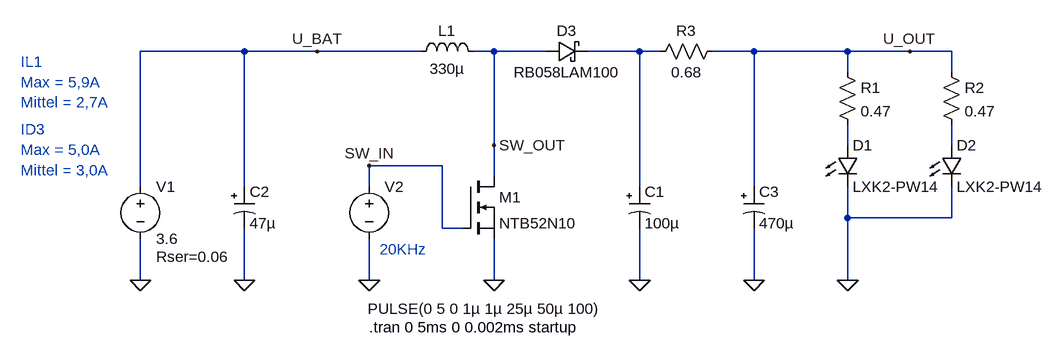
[diagram p0: schematic Boost_Converter.asc]
Boost_Converter.asc, the LTspice schematic file:
Version 4
SHEET 1 996 680
WIRE -240 176 -400 176
WIRE -128 176 -240 176
WIRE 32 176 -128 176
WIRE 144 176 112 176
WIRE 224 176 144 176
WIRE 368 176 288 176
WIRE 400 176 368 176
WIRE 544 176 480 176
WIRE 688 176 544 176
WIRE 784 176 688 176
WIRE 848 176 784 176
WIRE 688 208 688 176
WIRE 848 208 848 176
WIRE 144 320 144 176
WIRE 688 320 688 288
WIRE 848 320 848 288
WIRE 64 352 -48 352
WIRE 144 368 144 320
WIRE -400 384 -400 176
WIRE -240 384 -240 176
WIRE -48 384 -48 352
WIRE 368 384 368 176
WIRE 544 384 544 176
WIRE 688 432 688 384
WIRE 848 432 848 384
WIRE 848 432 688 432
WIRE 64 448 64 352
WIRE 96 448 64 448
WIRE -400 528 -400 464
WIRE -240 528 -240 448
WIRE -48 528 -48 464
WIRE 144 528 144 464
WIRE 368 528 368 448
WIRE 544 528 544 448
WIRE 688 528 688 432
FLAG -400 528 0
FLAG -48 528 0
FLAG 144 528 0
FLAG 688 528 0
FLAG 368 528 0
FLAG -48 352 SW_IN
FLAG 144 320 SW_OUT
FLAG -128 176 U_BAT
FLAG 784 176 U_OUT
FLAG -240 528 0
FLAG 544 528 0
SYMBOL voltage -400 368 R0
WINDOW 123 0 0 Left 0
WINDOW 39 24 124 Left 2
SYMATTR SpiceLine Rser=0.06
SYMATTR InstName V1
SYMATTR Value 3.6
SYMBOL res 672 192 R0
SYMATTR InstName R1
SYMATTR Value 0.47
SYMATTR SpiceLine tol=2 pwr=1
SYMBOL res 832 192 R0
SYMATTR InstName R2
SYMATTR Value 0.47
SYMATTR SpiceLine tol=2 pwr=1
SYMBOL LED 672 320 R0
SYMATTR InstName D1
SYMATTR Value LXK2-PW14
SYMATTR Description Diode
SYMATTR Type diode
SYMBOL LED 832 320 R0
SYMATTR InstName D2
SYMATTR Value LXK2-PW14
SYMATTR Description Diode
SYMATTR Type diode
SYMBOL nmos 96 368 R0
SYMATTR InstName M1
SYMATTR Value NTB52N10
SYMBOL voltage -48 368 R0
WINDOW 3 -2 204 Left 2
WINDOW 123 0 0 Left 0
WINDOW 39 0 0 Left 0
SYMATTR Value PULSE(0 5 0 1µ 1µ 25µ 50µ 100)
SYMATTR InstName V2
SYMBOL polcap 352 384 R0
WINDOW 3 24 56 Left 2
SYMATTR Value 100µ
SYMATTR InstName C1
SYMATTR Description Capacitor
SYMATTR Type cap
SYMATTR SpiceLine V=25 Irms=750m Rser=0.16 Lser=0
SYMBOL ind 16 192 R270
WINDOW 0 32 56 VTop 2
WINDOW 3 5 56 VBottom 2
SYMATTR InstName L1
SYMATTR Value 330µ
SYMATTR SpiceLine Ipk=2.8 Rser=0.23 Rpar=86577.4 Cpar=0
SYMBOL schottky 224 192 R270
WINDOW 0 32 32 VTop 2
WINDOW 3 0 32 VBottom 2
SYMATTR InstName D3
SYMATTR Value RB058LAM100
SYMATTR Description Diode
SYMATTR Type diode
SYMBOL polcap -256 384 R0
WINDOW 3 24 56 Left 2
SYMATTR Value 47µ
SYMATTR InstName C2
SYMATTR Description Capacitor
SYMATTR Type cap
SYMATTR SpiceLine V=25 Irms=750m Rser=0.16 Lser=0
SYMBOL polcap 528 384 R0
WINDOW 3 24 56 Left 2
SYMATTR Value 470µ
SYMATTR InstName C3
SYMATTR Description Capacitor
SYMATTR Type cap
SYMATTR SpiceLine V=25 Irms=750m Rser=0.16 Lser=0
SYMBOL res 496 160 R90
WINDOW 0 0 56 VBottom 2
WINDOW 3 32 56 VTop 2
SYMATTR InstName R3
SYMATTR Value 0.68
SYMATTR SpiceLine tol=2 pwr=1
TEXT -48 600 Left 2 !.tran 0 5ms 0 0.002ms startup
TEXT -584 192 Left 2 ;IL1\nMax = 5,9A\nMittel = 2,7A
TEXT -584 296 Left 2 ;ID3\nMax = 5,0A\nMittel = 3,0A
TEXT -32 480 Left 2 ;20KHz

The netlist it stands for:
* Boost_Converter.asc
V1 U_BAT 0 3.6 Rser=0.06
R1 U_OUT N002 0.47 tol=2 pwr=1
R2 U_OUT N003 0.47 tol=2 pwr=1
D1 N002 0 LXK2-PW14
D2 N003 0 LXK2-PW14
M1 SW_OUT SW_IN 0 0 NTB52N10
V2 SW_IN 0 PULSE(0 5 0 1µ 1µ 25µ 50µ 100)
C1 N001 0 100µ V=25 Irms=750m Rser=0.16 Lser=0
L1 U_BAT SW_OUT 330µ Ipk=2.8 Rser=0.23 Rpar=86577.4 Cpar=0
D3 SW_OUT N001 RB058LAM100
C2 U_BAT 0 47µ V=25 Irms=750m Rser=0.16 Lser=0
C3 U_OUT 0 470µ V=25 Irms=750m Rser=0.16 Lser=0
R3 U_OUT N001 0.68 tol=2 pwr=1
.model D D
.lib standard.dio
.model NMOS NMOS
.model PMOS PMOS
.lib standard.mos
.tran 0 5ms 0 0.002ms startup
* IL1
* Max = 5,9A
* Mittel = 2,7A
* ID3
* Max = 5,0A
* Mittel = 3,0A
* 20KHz
.backanno
.end